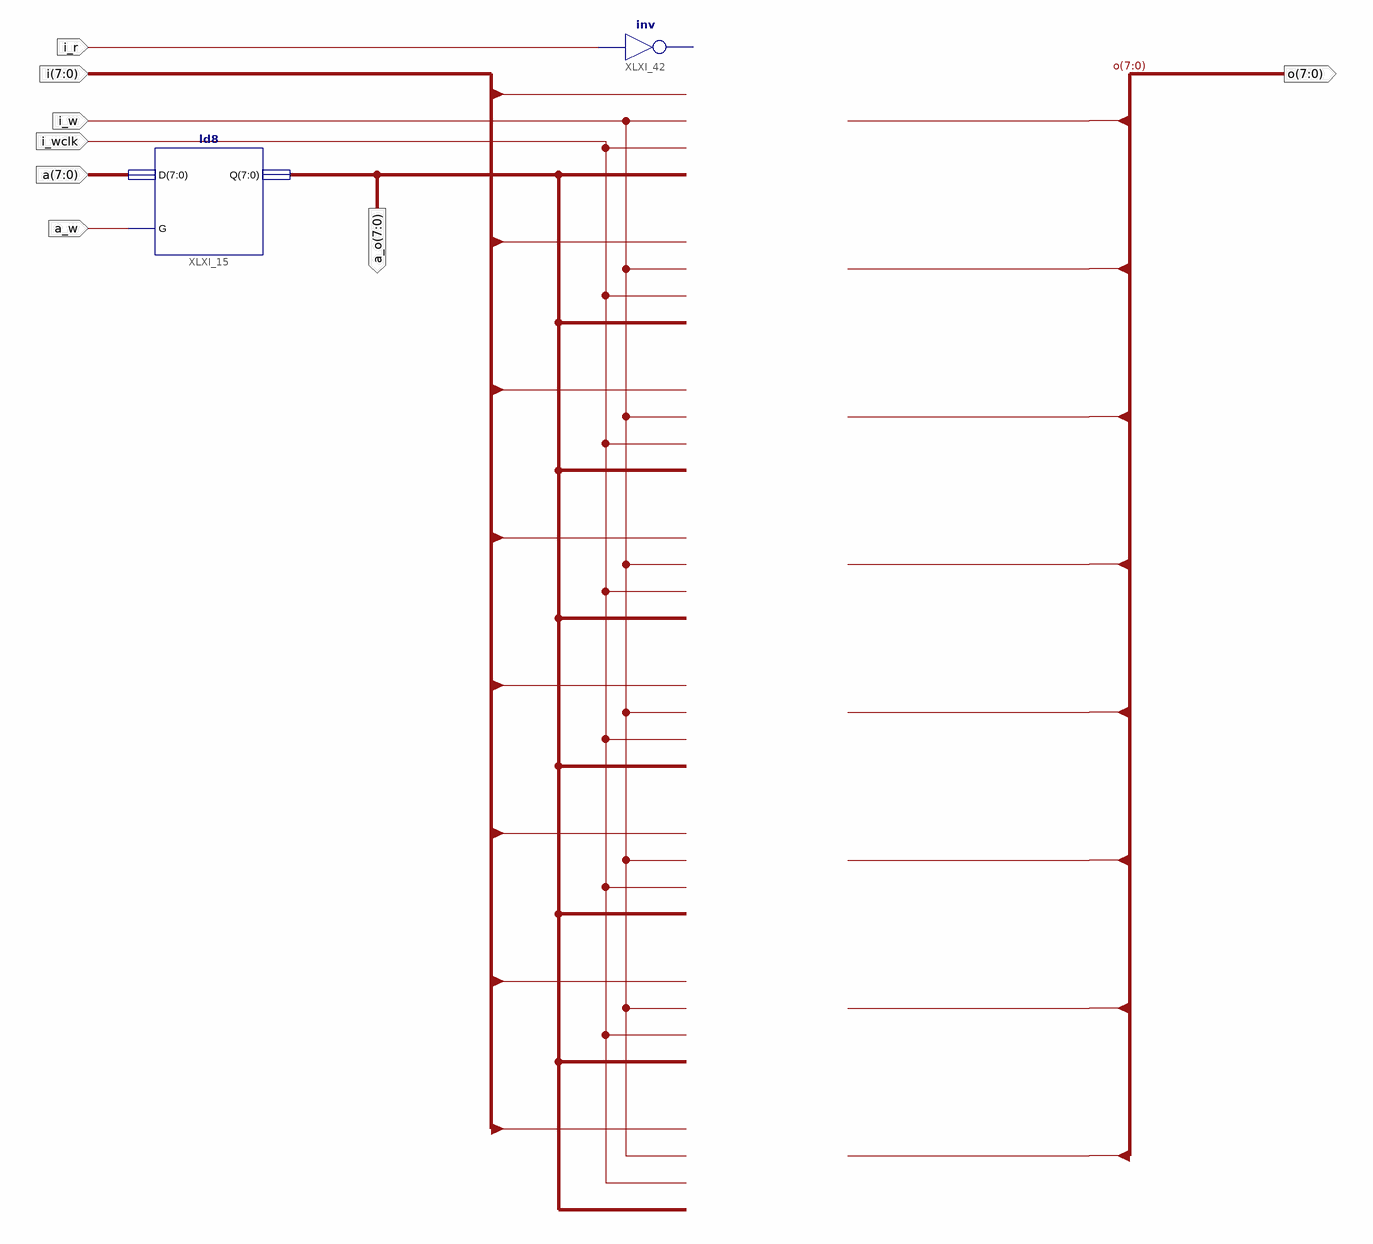
[diagram p0: schematic sheet 1]
// Xilinx ISE schematic ram_256bytes.sch (spartan3e) as structural Verilog: 2 symbols, 8 ports
module ram_256bytes (
  input  a_w,
  input  [7:0] a,
  input  [7:0] i,
  input  i_r,
  input  i_wclk,
  input  i_w,
  output [7:0] a_o,
  output [7:0] o
);

  ld8 XLXI_15 (.D(a), .G(a_w), .Q(a_o));
  // inv XLXI_42 has open pins: I=i_r, O=open
endmodule
